# Altium schematic sheet QuadDacDriver.SchDoc: 4-Channel 12-bit DAC with 23V 50mA Output Capability
size A4
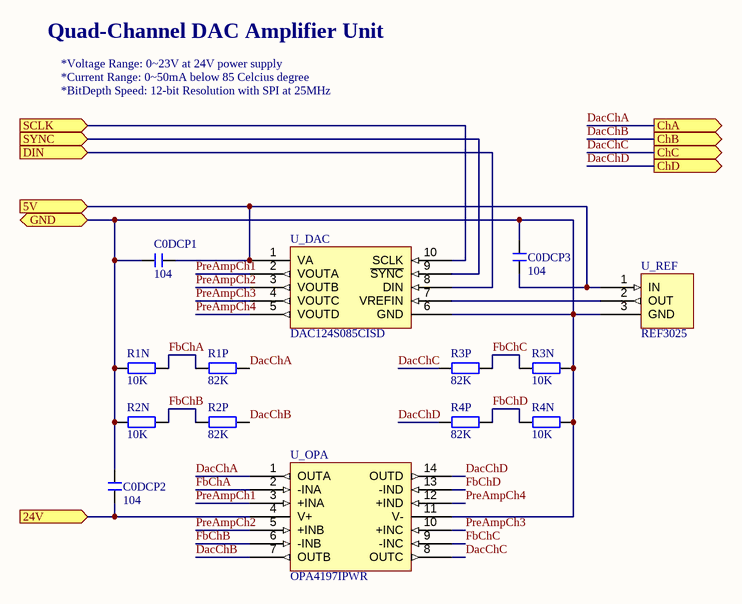
[diagram p0: QuadDacDriver.SchDoc]

## Parts
C0DCP1  104  [C 0603_L]
C0DCP2  104  [C 0603_L]
C0DCP3  104  [C 0603_L]
R1N  10K  [R 0603_L]
R1P  82K  [R 0603_L]
R2N  10K  [R 0603_L]
R2P  82K  [R 0603_L]
R3N  10K  [R 0603_L]
R3P  82K  [R 0603_L]
R4N  10K  [R 0603_L]
R4P  82K  [R 0603_L]
U_DAC  DAC124S085CISD  [VSSOP-10]
U_OPA  OPA4197IPWR  [TSSOP-14]
U_REF  REF3025  [SOT23-3]

## Ports
5V (in), 24V (in), ChA (out), ChB (out), ChC (out), ChD (out), DIN (in), GND (bidir), SCLK (in), SYNC (in)

## Nets
5V: C0DCP1.1 C0DCP3.2 U_DAC.1(VA) U_REF.1(IN) ; port 5V
24V: C0DCP2.1 U_OPA.4(V+) ; port 24V
DacChA: R1P.2 U_OPA.1(OUTA) ; port ChA
DacChB: R2P.2 U_OPA.7(OUTB) ; port ChB
DacChC: R3P.1 U_OPA.8(OUTC) ; port ChC
DacChD: R4P.1 U_OPA.14(OUTD) ; port ChD
DIN: U_DAC.8(DIN) ; port DIN
FbChA: R1N.2 R1P.1 U_OPA.2(-INA)
FbChB: R2N.2 R2P.1 U_OPA.6(-INB)
FbChC: R3N.1 R3P.2 U_OPA.9(-INC)
FbChD: R4N.1 R4P.2 U_OPA.13(-IND)
GND: C0DCP1.2 C0DCP2.2 C0DCP3.1 R1N.1 R2N.1 R3N.2 R4N.2 U_DAC.6(GND) U_OPA.11(V-) U_REF.3(GND) ; port GND
PreAmpCh1: U_DAC.2(VOUTA) U_OPA.3(+INA)
PreAmpCh2: U_DAC.3(VOUTB) U_OPA.5(+INB)
PreAmpCh3: U_DAC.4(VOUTC) U_OPA.10(+INC)
PreAmpCh4: U_DAC.5(VOUTD) U_OPA.12(+IND)
SCLK: U_DAC.10(SCLK) ; port SCLK
SYNC: U_DAC.9(~{SYNC}) ; port SYNC
NetU_DAC_7: U_DAC.7(VREFIN) U_REF.2(OUT)

## Notes on the sheet
- Quad-Channel DAC Amplifier Unit
- *Voltage Range: 0~23V at 24V power supply
- *Current Range: 0~50mA below 85 Celcius degree
- *BitDepth Speed: 12-bit Resolution with SPI at 25MHz
- Title
- FileName:
- Version:
- Date:
- Project
- Designed By:
- Descriptions:
- Sheet:
- of

## Library data of the parts
C0DCP1-C0DCP3 = C: 贴片电容; BOM名称: 无极性贴片电容; 淘宝ID: 封装库来自淘宝 ID：黄晶宝石; 联系售后，技术支持: https://shop463601444.taobao.com; 唯一出售店铺网址: https://shop463601444.taobao.com
R1N R1P R2N R2P R3N R3P R4N R4P = R: 贴片电阻; 版权归属: 来自淘宝 ID：黄晶宝石; 封装库来自淘宝卖家 ID：黄晶宝石: 其他店铺购入均为盗版，不享受售后技术支持服务，请立即申请退款; BOM名称: 贴片电阻; 联系售后: https://shop463601444.taobao.com
U_DAC = DAC104S085CISD: TI 10-bit Quad-channel DAC (NOPB)
U_OPA = OPA4197IPWR: Quad-channel Operational Amplifier
U_REF = REF3030AIDBZT: 3V Reference Source